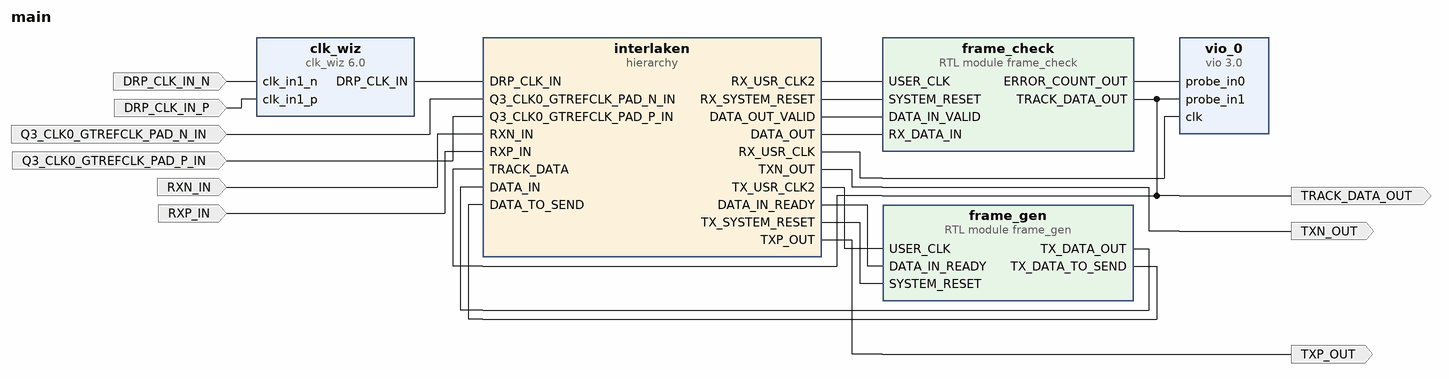
[diagram p0: block diagram of the top level]
# Vivado block design main, xc7k325tffg900-2, Vivado 2018.2
create_bd_design main

create_bd_port -dir I Q3_CLK0_GTREFCLK_PAD_N_IN
create_bd_port -dir I Q3_CLK0_GTREFCLK_PAD_P_IN
create_bd_port -dir I RXN_IN
create_bd_port -dir I RXP_IN
create_bd_port -dir O TXN_OUT
create_bd_port -dir O TXP_OUT
create_bd_port -dir O TRACK_DATA_OUT
create_bd_port -dir I -type clk DRP_CLK_IN_N
create_bd_port -dir I -type clk DRP_CLK_IN_P

create_bd_cell -type ip -vlnv xilinx.com:ip:clk_wiz:6.0 clk_wiz
set_property -dict [list \
  CONFIG.PRIM_IN_FREQ 200.000 \
  CONFIG.CLKIN1_JITTER_PS 50.0 \
  CONFIG.CLK_OUT1_PORT DRP_CLK_IN \
  CONFIG.PRIM_SOURCE Differential_clock_capable_pin \
  CONFIG.USE_LOCKED false \
  CONFIG.USE_RESET false \
  CONFIG.MMCM_DIVCLK_DIVIDE 1 \
  CONFIG.MMCM_CLKFBOUT_MULT_F 5.000 \
  CONFIG.MMCM_CLKIN1_PERIOD 5.000 \
  CONFIG.MMCM_CLKIN2_PERIOD 10.0 \
  CONFIG.CLKOUT1_JITTER 112.316 \
  CONFIG.CLKOUT1_PHASE_ERROR 89.971 \
] [get_bd_cells clk_wiz]
create_bd_cell -type hier interlaken
create_bd_cell -type ip -vlnv xilinx.com:ip:vio:3.0 vio_0
set_property -dict {CONFIG.C_NUM_PROBE_OUT 0 CONFIG.C_NUM_PROBE_IN 2} [get_bd_cells vio_0]
create_bd_cell -type module -reference frame_check frame_check
create_bd_cell -type module -reference frame_gen frame_gen

# ---- hierarchy /interlaken ----
current_bd_instance /interlaken
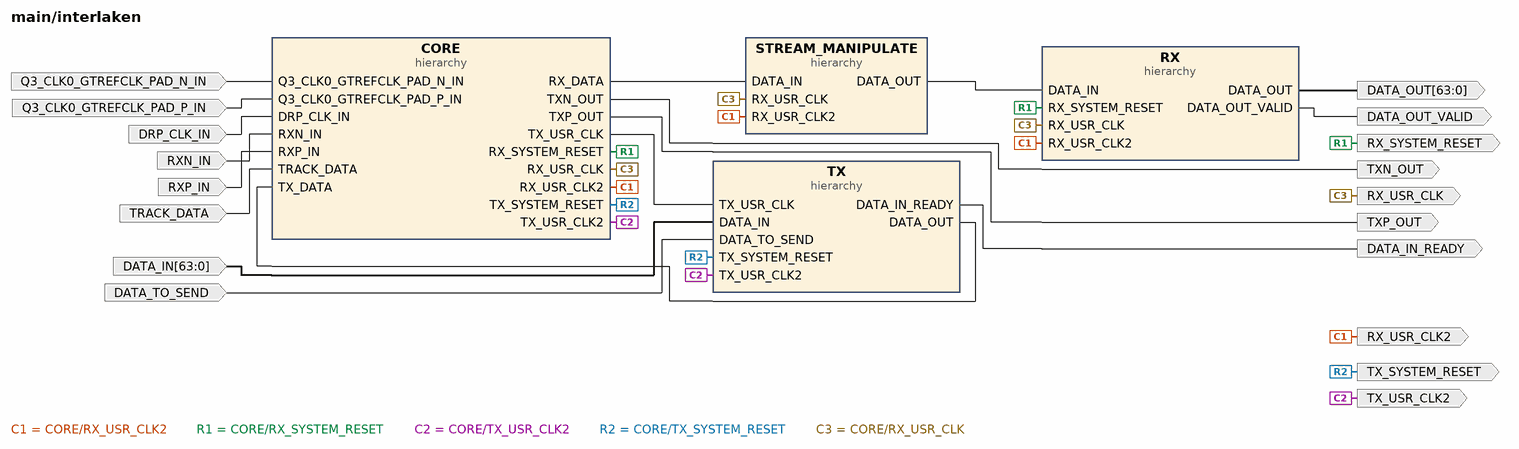
[diagram p1: block diagram inside /interlaken]
create_bd_pin -dir O -type clk RX_USR_CLK2
create_bd_pin -dir I -type clk Q3_CLK0_GTREFCLK_PAD_N_IN
create_bd_pin -dir I -type clk Q3_CLK0_GTREFCLK_PAD_P_IN
create_bd_pin -dir I -type clk DRP_CLK_IN
create_bd_pin -dir I RXN_IN
create_bd_pin -dir I RXP_IN
create_bd_pin -dir O TXN_OUT
create_bd_pin -dir O TXP_OUT
create_bd_pin -dir O -type clk TX_USR_CLK2
create_bd_pin -dir I TRACK_DATA
create_bd_pin -dir I -from 63 -to 0 DATA_IN
create_bd_pin -dir I DATA_TO_SEND
create_bd_pin -dir O DATA_IN_READY
create_bd_pin -dir O -type clk RX_USR_CLK
create_bd_pin -dir O -type rst TX_SYSTEM_RESET
create_bd_pin -dir O -type rst RX_SYSTEM_RESET
create_bd_pin -dir O DATA_OUT_VALID
create_bd_pin -dir O -from 63 -to 0 DATA_OUT

create_bd_cell -type hier CORE
create_bd_cell -type hier RX
create_bd_cell -type hier TX
create_bd_cell -type hier STREAM_MANIPULATE

# ---- hierarchy /interlaken/CORE ----
current_bd_instance /interlaken/CORE
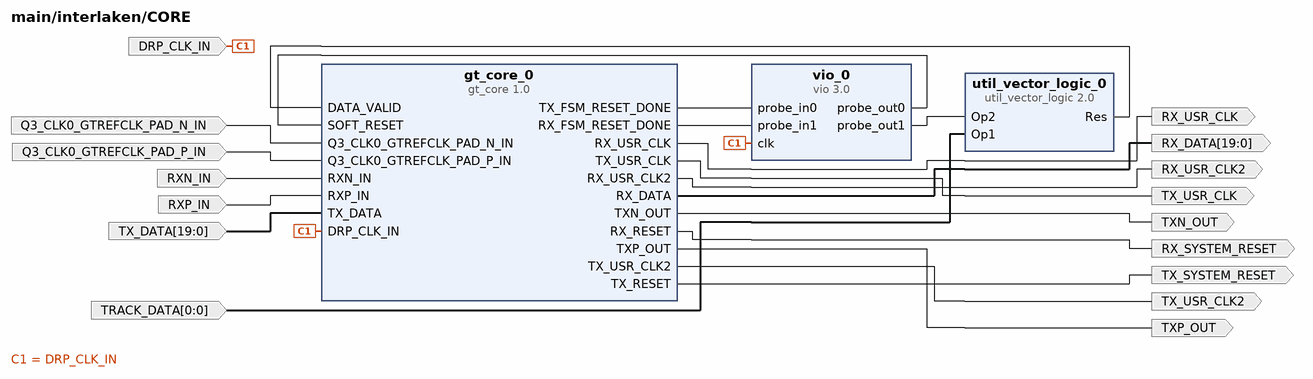
[diagram p2: block diagram inside /interlaken/CORE]
create_bd_pin -dir I -type clk Q3_CLK0_GTREFCLK_PAD_N_IN
create_bd_pin -dir I -type clk Q3_CLK0_GTREFCLK_PAD_P_IN
create_bd_pin -dir I -type clk DRP_CLK_IN
create_bd_pin -dir I RXN_IN
create_bd_pin -dir I RXP_IN
create_bd_pin -dir O TXN_OUT
create_bd_pin -dir O TXP_OUT
create_bd_pin -dir O -type clk TX_USR_CLK
create_bd_pin -dir O -type clk TX_USR_CLK2
create_bd_pin -dir O -type clk RX_USR_CLK
create_bd_pin -dir O -type clk RX_USR_CLK2
create_bd_pin -dir O -type rst TX_SYSTEM_RESET
create_bd_pin -dir O -type rst RX_SYSTEM_RESET
create_bd_pin -dir O -from 19 -to 0 RX_DATA
create_bd_pin -dir I -from 19 -to 0 TX_DATA
create_bd_pin -dir I -from 0 -to 0 TRACK_DATA

create_bd_cell -type ip -vlnv xilinx.com:ip:util_vector_logic:2.0 util_vector_logic_0
set_property -dict {CONFIG.C_SIZE 1 CONFIG.C_OPERATION or} [get_bd_cells util_vector_logic_0]
create_bd_cell -type ip -vlnv xilinx.com:ip:vio:3.0 vio_0
set_property -dict [list \
  CONFIG.C_PROBE_OUT1_INIT_VAL 0x0 \
  CONFIG.C_NUM_PROBE_OUT 2 \
  CONFIG.C_EN_PROBE_IN_ACTIVITY 0 \
  CONFIG.C_NUM_PROBE_IN 2 \
] [get_bd_cells vio_0]
create_bd_cell -type ip -vlnv xilinx.com:user:gt_core:1.0 gt_core_0
set_property -dict {CONFIG.LOOPBACK {"000"}} [get_bd_cells gt_core_0]

# ---- hierarchy /interlaken/RX ----
current_bd_instance /interlaken/RX
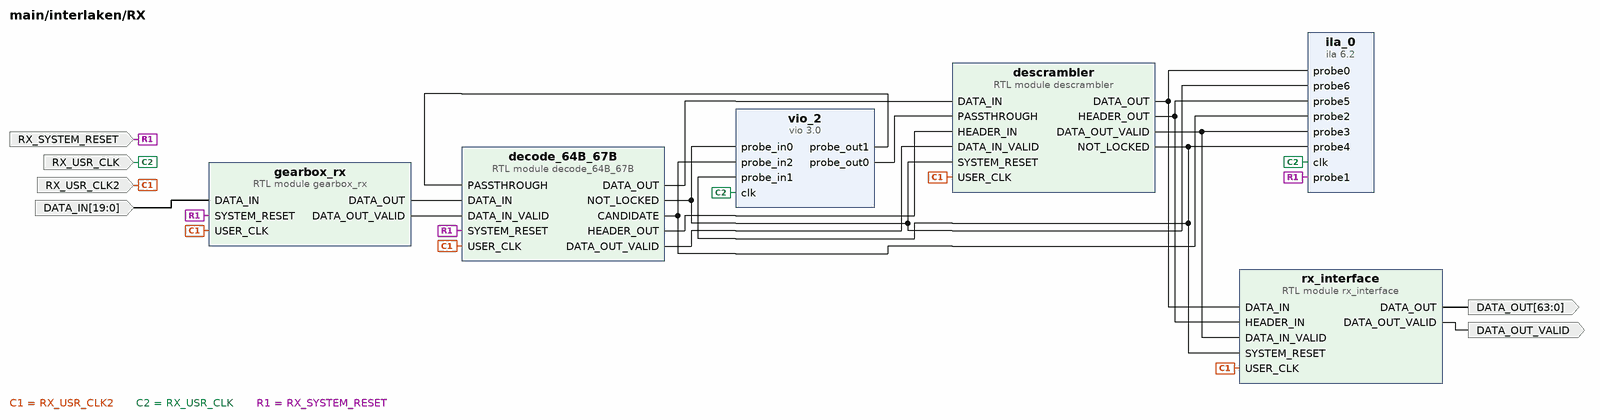
[diagram p3: block diagram inside /interlaken/RX]
create_bd_pin -dir I -type clk RX_USR_CLK2
create_bd_pin -dir I -type clk RX_USR_CLK
create_bd_pin -dir I -type rst RX_SYSTEM_RESET
create_bd_pin -dir I -from 19 -to 0 DATA_IN
create_bd_pin -dir O DATA_OUT_VALID
create_bd_pin -dir O -from 63 -to 0 DATA_OUT

create_bd_cell -type ip -vlnv xilinx.com:ip:vio:3.0 vio_2
set_property -dict [list \
  CONFIG.C_PROBE_OUT1_INIT_VAL 0x0 \
  CONFIG.C_PROBE_OUT0_INIT_VAL 0x0 \
  CONFIG.C_PROBE_OUT3_WIDTH 20 \
  CONFIG.C_PROBE_OUT2_WIDTH 6 \
  CONFIG.C_NUM_PROBE_OUT 2 \
  CONFIG.C_EN_PROBE_IN_ACTIVITY 1 \
  CONFIG.C_NUM_PROBE_IN 3 \
] [get_bd_cells vio_2]
create_bd_cell -type ip -vlnv xilinx.com:ip:ila:6.2 ila_0
set_property -dict [list \
  CONFIG.C_PROBE12_WIDTH 1 \
  CONFIG.C_PROBE11_WIDTH 1 \
  CONFIG.C_PROBE10_WIDTH 1 \
  CONFIG.C_PROBE9_WIDTH 1 \
  CONFIG.C_PROBE7_WIDTH 1 \
  CONFIG.C_PROBE6_WIDTH 1 \
  CONFIG.C_PROBE5_WIDTH 2 \
  CONFIG.C_PROBE4_WIDTH 1 \
  CONFIG.C_PROBE3_WIDTH 1 \
  CONFIG.C_PROBE2_WIDTH 7 \
  CONFIG.C_PROBE1_WIDTH 1 \
  CONFIG.C_PROBE0_WIDTH 64 \
  CONFIG.C_NUM_OF_PROBES 7 \
  CONFIG.C_ENABLE_ILA_AXI_MON false \
  CONFIG.C_MONITOR_TYPE Native \
] [get_bd_cells ila_0]
create_bd_cell -type module -reference rx_interface rx_interface
create_bd_cell -type module -reference decode_64B_67B decode_64B_67B
create_bd_cell -type module -reference gearbox_rx gearbox_rx
create_bd_cell -type module -reference descrambler descrambler
set_property -dict {CONFIG.META_FRAME_LEN 16} [get_bd_cells descrambler]

# ---- hierarchy /interlaken/TX ----
current_bd_instance /interlaken/TX
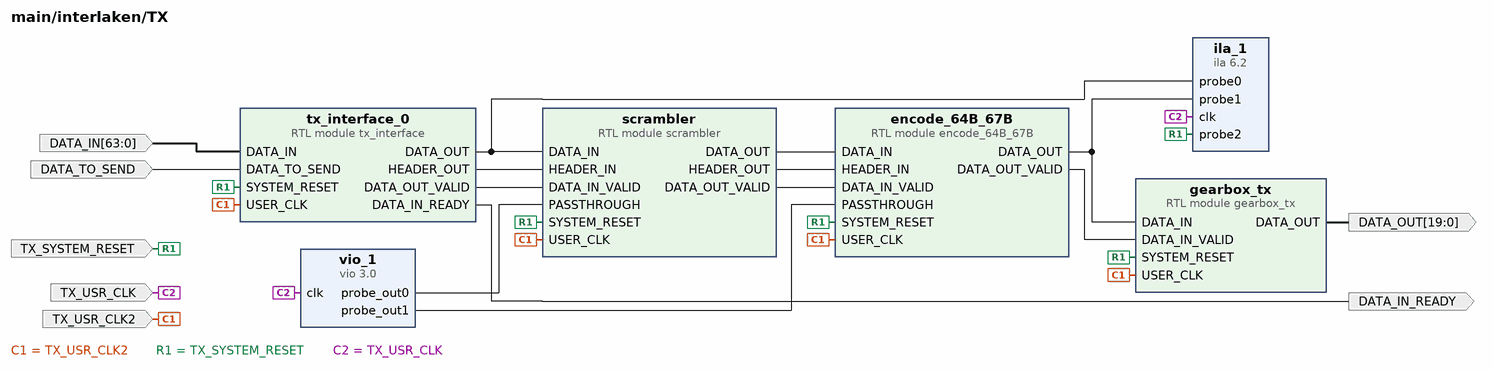
[diagram p4: block diagram inside /interlaken/TX]
create_bd_pin -dir O -from 19 -to 0 DATA_OUT
create_bd_pin -dir I -type clk TX_USR_CLK2
create_bd_pin -dir I -type rst TX_SYSTEM_RESET
create_bd_pin -dir I -from 63 -to 0 DATA_IN
create_bd_pin -dir I DATA_TO_SEND
create_bd_pin -dir O DATA_IN_READY
create_bd_pin -dir I -type clk TX_USR_CLK

create_bd_cell -type ip -vlnv xilinx.com:ip:vio:3.0 vio_1
set_property -dict [list \
  CONFIG.C_PROBE_OUT2_INIT_VAL 0x1 \
  CONFIG.C_PROBE_OUT1_INIT_VAL 0x0 \
  CONFIG.C_PROBE_OUT0_INIT_VAL 0x0 \
  CONFIG.C_NUM_PROBE_OUT 2 \
  CONFIG.C_NUM_PROBE_IN 0 \
] [get_bd_cells vio_1]
create_bd_cell -type ip -vlnv xilinx.com:ip:ila:6.2 ila_1
set_property -dict [list \
  CONFIG.C_PROBE5_WIDTH 1 \
  CONFIG.C_PROBE4_WIDTH 1 \
  CONFIG.C_PROBE3_WIDTH 1 \
  CONFIG.C_PROBE2_WIDTH 1 \
  CONFIG.C_PROBE1_WIDTH 67 \
  CONFIG.C_PROBE0_WIDTH 64 \
  CONFIG.C_NUM_OF_PROBES 3 \
  CONFIG.C_ENABLE_ILA_AXI_MON false \
  CONFIG.C_MONITOR_TYPE Native \
] [get_bd_cells ila_1]
create_bd_cell -type module -reference tx_interface tx_interface_0
create_bd_cell -type module -reference scrambler scrambler
create_bd_cell -type module -reference gearbox_tx gearbox_tx
create_bd_cell -type module -reference encode_64B_67B encode_64B_67B

# ---- hierarchy /interlaken/STREAM_MANIPULATE ----
current_bd_instance /interlaken/STREAM_MANIPULATE
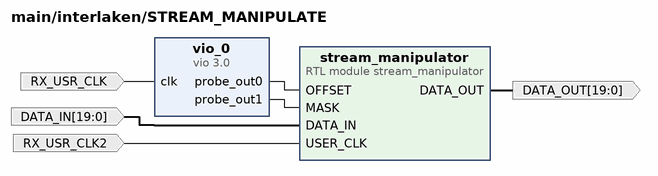
[diagram p5: block diagram inside /interlaken/STREAM_MANIPULATE]
create_bd_pin -dir I -from 19 -to 0 DATA_IN
create_bd_pin -dir O -from 19 -to 0 DATA_OUT
create_bd_pin -dir I -type clk RX_USR_CLK2
create_bd_pin -dir I -type clk RX_USR_CLK

create_bd_cell -type ip -vlnv xilinx.com:ip:vio:3.0 vio_0
set_property -dict [list \
  CONFIG.C_PROBE_OUT1_WIDTH 20 \
  CONFIG.C_PROBE_OUT0_WIDTH 6 \
  CONFIG.C_NUM_PROBE_OUT 2 \
  CONFIG.C_NUM_PROBE_IN 0 \
] [get_bd_cells vio_0]
create_bd_cell -type module -reference stream_manipulator stream_manipulator
set_property -dict {CONFIG.DATA_WIDTH 20} [get_bd_cells stream_manipulator]

# ---- connections ----

current_bd_instance /interlaken
connect_bd_net -net gt_core_0_RX_USR_CLK2 [get_bd_pins CORE/RX_USR_CLK2] \
  [get_bd_pins RX_USR_CLK2] [get_bd_pins RX/RX_USR_CLK2] [get_bd_pins STREAM_MANIPULATE/RX_USR_CLK2]
connect_bd_net -net gt_core_0_RX_SYSTEM_RESET [get_bd_pins CORE/RX_SYSTEM_RESET] [get_bd_pins RX_SYSTEM_RESET] [get_bd_pins RX/RX_SYSTEM_RESET]
connect_bd_net [get_bd_pins Q3_CLK0_GTREFCLK_PAD_N_IN] [get_bd_pins CORE/Q3_CLK0_GTREFCLK_PAD_N_IN]
connect_bd_net [get_bd_pins Q3_CLK0_GTREFCLK_PAD_P_IN] [get_bd_pins CORE/Q3_CLK0_GTREFCLK_PAD_P_IN]
connect_bd_net [get_bd_pins DRP_CLK_IN] [get_bd_pins CORE/DRP_CLK_IN]
connect_bd_net [get_bd_pins RXN_IN] [get_bd_pins CORE/RXN_IN]
connect_bd_net [get_bd_pins RXP_IN] [get_bd_pins CORE/RXP_IN]
connect_bd_net -net gt_core_0_TXN_OUT [get_bd_pins CORE/TXN_OUT] [get_bd_pins TXN_OUT]
connect_bd_net -net gt_core_0_TXP_OUT [get_bd_pins CORE/TXP_OUT] [get_bd_pins TXP_OUT]
connect_bd_net [get_bd_pins CORE/TX_USR_CLK2] [get_bd_pins TX_USR_CLK2] [get_bd_pins TX/TX_USR_CLK2]
connect_bd_net -net gt_core_0_TX_SYSTEM_RESET [get_bd_pins CORE/TX_SYSTEM_RESET] [get_bd_pins TX_SYSTEM_RESET] [get_bd_pins TX/TX_SYSTEM_RESET]
connect_bd_net [get_bd_pins TRACK_DATA] [get_bd_pins CORE/TRACK_DATA]
connect_bd_net -net gt_core_0_RX_USR_CLK [get_bd_pins CORE/RX_USR_CLK] \
  [get_bd_pins RX_USR_CLK] [get_bd_pins RX/RX_USR_CLK] [get_bd_pins STREAM_MANIPULATE/RX_USR_CLK]
connect_bd_net -net TX_DATA_IN_1 [get_bd_pins DATA_IN] [get_bd_pins TX/DATA_IN]
connect_bd_net [get_bd_pins DATA_TO_SEND] [get_bd_pins TX/DATA_TO_SEND]
connect_bd_net [get_bd_pins TX/DATA_IN_READY] [get_bd_pins DATA_IN_READY]
connect_bd_net -net TX_DATA_1 [get_bd_pins TX/DATA_OUT] [get_bd_pins CORE/TX_DATA]
connect_bd_net [get_bd_pins CORE/TX_USR_CLK] [get_bd_pins TX/TX_USR_CLK]
connect_bd_net -net stream_manipulator_DATA_OUT [get_bd_pins STREAM_MANIPULATE/DATA_OUT] [get_bd_pins RX/DATA_IN]
connect_bd_net [get_bd_pins CORE/RX_DATA] [get_bd_pins STREAM_MANIPULATE/DATA_IN]
connect_bd_net -net DESCRAMBLER_DATA_OUT_VALID [get_bd_pins RX/DATA_OUT_VALID] [get_bd_pins DATA_OUT_VALID]
connect_bd_net -net DESCRAMBLER_DATA_OUT [get_bd_pins RX/DATA_OUT] [get_bd_pins DATA_OUT]

current_bd_instance /interlaken/CORE
connect_bd_net [get_bd_pins util_vector_logic_0/Res] [get_bd_pins gt_core_0/DATA_VALID]
connect_bd_net -net SOFT_RESET [get_bd_pins vio_0/probe_out0] [get_bd_pins gt_core_0/SOFT_RESET]
connect_bd_net -net OVERRIDE_DATA_VALID [get_bd_pins vio_0/probe_out1] [get_bd_pins util_vector_logic_0/Op2]
connect_bd_net [get_bd_pins Q3_CLK0_GTREFCLK_PAD_N_IN] [get_bd_pins gt_core_0/Q3_CLK0_GTREFCLK_PAD_N_IN]
connect_bd_net [get_bd_pins Q3_CLK0_GTREFCLK_PAD_P_IN] [get_bd_pins gt_core_0/Q3_CLK0_GTREFCLK_PAD_P_IN]
connect_bd_net [get_bd_pins DRP_CLK_IN] [get_bd_pins vio_0/clk] [get_bd_pins gt_core_0/DRP_CLK_IN]
connect_bd_net [get_bd_pins RXN_IN] [get_bd_pins gt_core_0/RXN_IN]
connect_bd_net [get_bd_pins RXP_IN] [get_bd_pins gt_core_0/RXP_IN]
connect_bd_net [get_bd_pins gt_core_0/TXN_OUT] [get_bd_pins TXN_OUT]
connect_bd_net [get_bd_pins gt_core_0/TXP_OUT] [get_bd_pins TXP_OUT]
connect_bd_net [get_bd_pins gt_core_0/TX_USR_CLK] [get_bd_pins TX_USR_CLK]
connect_bd_net [get_bd_pins gt_core_0/TX_USR_CLK2] [get_bd_pins TX_USR_CLK2]
connect_bd_net [get_bd_pins gt_core_0/RX_USR_CLK] [get_bd_pins RX_USR_CLK]
connect_bd_net [get_bd_pins gt_core_0/RX_USR_CLK2] [get_bd_pins RX_USR_CLK2]
connect_bd_net -net gt_core_0_TX_SYSTEM_RESET [get_bd_pins gt_core_0/TX_RESET] [get_bd_pins TX_SYSTEM_RESET]
connect_bd_net -net gt_core_0_RX_SYSTEM_RESET [get_bd_pins gt_core_0/RX_RESET] [get_bd_pins RX_SYSTEM_RESET]
connect_bd_net -net GT_RX_DATA [get_bd_pins gt_core_0/RX_DATA] [get_bd_pins RX_DATA]
connect_bd_net -net GEARBOX_TX_DATA_OUT [get_bd_pins TX_DATA] [get_bd_pins gt_core_0/TX_DATA]
connect_bd_net [get_bd_pins TRACK_DATA] [get_bd_pins util_vector_logic_0/Op1]
connect_bd_net -net TX_FSM_RESET_DONE [get_bd_pins gt_core_0/TX_FSM_RESET_DONE] [get_bd_pins vio_0/probe_in0]
connect_bd_net -net RX_FSM_RESET_DONE [get_bd_pins gt_core_0/RX_FSM_RESET_DONE] [get_bd_pins vio_0/probe_in1]

current_bd_instance /interlaken/RX
connect_bd_net -net PASSTHROUGH_DESCRAMBLER [get_bd_pins vio_2/probe_out0] [get_bd_pins descrambler/PASSTHROUGH]
connect_bd_net -net PASSTHROUGH_DECODER [get_bd_pins vio_2/probe_out1] [get_bd_pins decode_64B_67B/PASSTHROUGH]
connect_bd_net [get_bd_pins gearbox_rx/DATA_OUT] [get_bd_pins decode_64B_67B/DATA_IN]
connect_bd_net [get_bd_pins gearbox_rx/DATA_OUT_VALID] [get_bd_pins decode_64B_67B/DATA_IN_VALID]
connect_bd_net -net DECODER_DATA_OUT [get_bd_pins decode_64B_67B/DATA_OUT] [get_bd_pins descrambler/DATA_IN]
connect_bd_net [get_bd_pins decode_64B_67B/HEADER_OUT] [get_bd_pins descrambler/HEADER_IN]
connect_bd_net -net DECODER_DATA_OUT_VALID [get_bd_pins decode_64B_67B/DATA_OUT_VALID] [get_bd_pins descrambler/DATA_IN_VALID]
connect_bd_net -net gt_core_0_RX_USR_CLK2 [get_bd_pins RX_USR_CLK2] \
  [get_bd_pins rx_interface/USER_CLK] [get_bd_pins decode_64B_67B/USER_CLK] [get_bd_pins gearbox_rx/USER_CLK] \
  [get_bd_pins descrambler/USER_CLK]
connect_bd_net -net gt_core_0_RX_USR_CLK [get_bd_pins RX_USR_CLK] [get_bd_pins vio_2/clk] [get_bd_pins ila_0/clk]
connect_bd_net [get_bd_pins decode_64B_67B/NOT_LOCKED] [get_bd_pins vio_2/probe_in0] [get_bd_pins ila_0/probe6] [get_bd_pins descrambler/SYSTEM_RESET]
connect_bd_net [get_bd_pins descrambler/NOT_LOCKED] [get_bd_pins vio_2/probe_in1] [get_bd_pins ila_0/probe4] [get_bd_pins rx_interface/SYSTEM_RESET]
connect_bd_net -net CANDIDATE [get_bd_pins decode_64B_67B/CANDIDATE] [get_bd_pins vio_2/probe_in2] [get_bd_pins ila_0/probe2]
connect_bd_net [get_bd_pins RX_SYSTEM_RESET] \
  [get_bd_pins ila_0/probe1] [get_bd_pins decode_64B_67B/SYSTEM_RESET] [get_bd_pins gearbox_rx/SYSTEM_RESET]
connect_bd_net [get_bd_pins descrambler/DATA_OUT] [get_bd_pins ila_0/probe0] [get_bd_pins rx_interface/DATA_IN]
connect_bd_net [get_bd_pins descrambler/HEADER_OUT] [get_bd_pins ila_0/probe5] [get_bd_pins rx_interface/HEADER_IN]
connect_bd_net [get_bd_pins descrambler/DATA_OUT_VALID] [get_bd_pins ila_0/probe3] [get_bd_pins rx_interface/DATA_IN_VALID]
connect_bd_net [get_bd_pins DATA_IN] [get_bd_pins gearbox_rx/DATA_IN]
connect_bd_net -net rx_interface_0_DATA_OUT_VALID [get_bd_pins rx_interface/DATA_OUT_VALID] [get_bd_pins DATA_OUT_VALID]
connect_bd_net -net rx_interface_0_DATA_OUT [get_bd_pins rx_interface/DATA_OUT] [get_bd_pins DATA_OUT]

current_bd_instance /interlaken/TX
connect_bd_net [get_bd_pins encode_64B_67B/DATA_OUT_VALID] [get_bd_pins gearbox_tx/DATA_IN_VALID]
connect_bd_net -net SCRAMBLED_DATA_OUT [get_bd_pins scrambler/DATA_OUT] [get_bd_pins encode_64B_67B/DATA_IN]
connect_bd_net -net scrambler_0_HEADER_OUT [get_bd_pins scrambler/HEADER_OUT] [get_bd_pins encode_64B_67B/HEADER_IN]
connect_bd_net [get_bd_pins scrambler/DATA_OUT_VALID] [get_bd_pins encode_64B_67B/DATA_IN_VALID]
connect_bd_net -net PASSTHROUGH_ENCODER [get_bd_pins vio_1/probe_out1] [get_bd_pins encode_64B_67B/PASSTHROUGH]
connect_bd_net [get_bd_pins tx_interface_0/HEADER_OUT] [get_bd_pins scrambler/HEADER_IN]
connect_bd_net -net tx_interface_0_DATA_VALID [get_bd_pins tx_interface_0/DATA_OUT_VALID] [get_bd_pins scrambler/DATA_IN_VALID]
connect_bd_net -net PASSTHROUGH_SCRAMBLER [get_bd_pins vio_1/probe_out0] [get_bd_pins scrambler/PASSTHROUGH]
connect_bd_net -net ENCODER_DATA_OUT [get_bd_pins encode_64B_67B/DATA_OUT] [get_bd_pins ila_1/probe1] [get_bd_pins gearbox_tx/DATA_IN]
connect_bd_net [get_bd_pins gearbox_tx/DATA_OUT] [get_bd_pins DATA_OUT]
connect_bd_net [get_bd_pins TX_USR_CLK2] \
  [get_bd_pins tx_interface_0/USER_CLK] [get_bd_pins scrambler/USER_CLK] [get_bd_pins gearbox_tx/USER_CLK] \
  [get_bd_pins encode_64B_67B/USER_CLK]
connect_bd_net [get_bd_pins TX_SYSTEM_RESET] \
  [get_bd_pins ila_1/probe2] [get_bd_pins tx_interface_0/SYSTEM_RESET] [get_bd_pins scrambler/SYSTEM_RESET] \
  [get_bd_pins gearbox_tx/SYSTEM_RESET] [get_bd_pins encode_64B_67B/SYSTEM_RESET]
connect_bd_net -net TX_INTERFACE_DATA_OUT [get_bd_pins tx_interface_0/DATA_OUT] [get_bd_pins ila_1/probe0] [get_bd_pins scrambler/DATA_IN]
connect_bd_net -net gt_frame_gen_0_TX_DATA_OUT [get_bd_pins DATA_IN] [get_bd_pins tx_interface_0/DATA_IN]
connect_bd_net [get_bd_pins DATA_TO_SEND] [get_bd_pins tx_interface_0/DATA_TO_SEND]
connect_bd_net [get_bd_pins tx_interface_0/DATA_IN_READY] [get_bd_pins DATA_IN_READY]
connect_bd_net -net gt_core_0_TX_USR_CLK [get_bd_pins TX_USR_CLK] [get_bd_pins vio_1/clk] [get_bd_pins ila_1/clk]

current_bd_instance /interlaken/STREAM_MANIPULATE
connect_bd_net -net CORE_RX_DATA [get_bd_pins DATA_IN] [get_bd_pins stream_manipulator/DATA_IN]
connect_bd_net [get_bd_pins stream_manipulator/DATA_OUT] [get_bd_pins DATA_OUT]
connect_bd_net -net gt_core_0_RX_USR_CLK2 [get_bd_pins RX_USR_CLK2] [get_bd_pins stream_manipulator/USER_CLK]
connect_bd_net [get_bd_pins RX_USR_CLK] [get_bd_pins vio_0/clk]
connect_bd_net -net OFFSET [get_bd_pins vio_0/probe_out0] [get_bd_pins stream_manipulator/OFFSET]
connect_bd_net -net MASK [get_bd_pins vio_0/probe_out1] [get_bd_pins stream_manipulator/MASK]

current_bd_instance /
connect_bd_net [get_bd_ports Q3_CLK0_GTREFCLK_PAD_N_IN] [get_bd_pins interlaken/Q3_CLK0_GTREFCLK_PAD_N_IN]
connect_bd_net [get_bd_ports Q3_CLK0_GTREFCLK_PAD_P_IN] [get_bd_pins interlaken/Q3_CLK0_GTREFCLK_PAD_P_IN]
connect_bd_net [get_bd_ports RXN_IN] [get_bd_pins interlaken/RXN_IN]
connect_bd_net [get_bd_ports RXP_IN] [get_bd_pins interlaken/RXP_IN]
connect_bd_net -net gt_core_0_TXN_OUT [get_bd_pins interlaken/TXN_OUT] [get_bd_ports TXN_OUT]
connect_bd_net -net gt_core_0_TXP_OUT [get_bd_pins interlaken/TXP_OUT] [get_bd_ports TXP_OUT]
connect_bd_net -net gt_core_0_RX_USR_CLK2 [get_bd_pins interlaken/RX_USR_CLK2] [get_bd_pins frame_check/USER_CLK]
connect_bd_net -net TRACK_DATA_OUT [get_bd_pins frame_check/TRACK_DATA_OUT] \
  [get_bd_ports TRACK_DATA_OUT] [get_bd_pins vio_0/probe_in1] [get_bd_pins interlaken/TRACK_DATA]
connect_bd_net [get_bd_ports DRP_CLK_IN_N] [get_bd_pins clk_wiz/clk_in1_n]
connect_bd_net [get_bd_ports DRP_CLK_IN_P] [get_bd_pins clk_wiz/clk_in1_p]
connect_bd_net -net DRP_CLK_IN [get_bd_pins clk_wiz/DRP_CLK_IN] [get_bd_pins interlaken/DRP_CLK_IN]
connect_bd_net [get_bd_pins interlaken/TX_USR_CLK2] [get_bd_pins frame_gen/USER_CLK]
connect_bd_net [get_bd_pins frame_gen/TX_DATA_OUT] [get_bd_pins interlaken/DATA_IN]
connect_bd_net [get_bd_pins frame_gen/TX_DATA_TO_SEND] [get_bd_pins interlaken/DATA_TO_SEND]
connect_bd_net [get_bd_pins interlaken/DATA_IN_READY] [get_bd_pins frame_gen/DATA_IN_READY]
connect_bd_net -net ERROR_COUNT_OUT [get_bd_pins frame_check/ERROR_COUNT_OUT] [get_bd_pins vio_0/probe_in0]
connect_bd_net [get_bd_pins interlaken/TX_SYSTEM_RESET] [get_bd_pins frame_gen/SYSTEM_RESET]
connect_bd_net [get_bd_pins interlaken/RX_SYSTEM_RESET] [get_bd_pins frame_check/SYSTEM_RESET]
connect_bd_net [get_bd_pins interlaken/RX_USR_CLK] [get_bd_pins vio_0/clk]
connect_bd_net [get_bd_pins interlaken/DATA_OUT_VALID] [get_bd_pins frame_check/DATA_IN_VALID]
connect_bd_net -net descrambler_UNSCRAMBLED_DATA_OUT [get_bd_pins interlaken/DATA_OUT] [get_bd_pins frame_check/RX_DATA_IN]

validate_bd_design
save_bd_design
